# Altium project Internship_IITB.PrjPcb
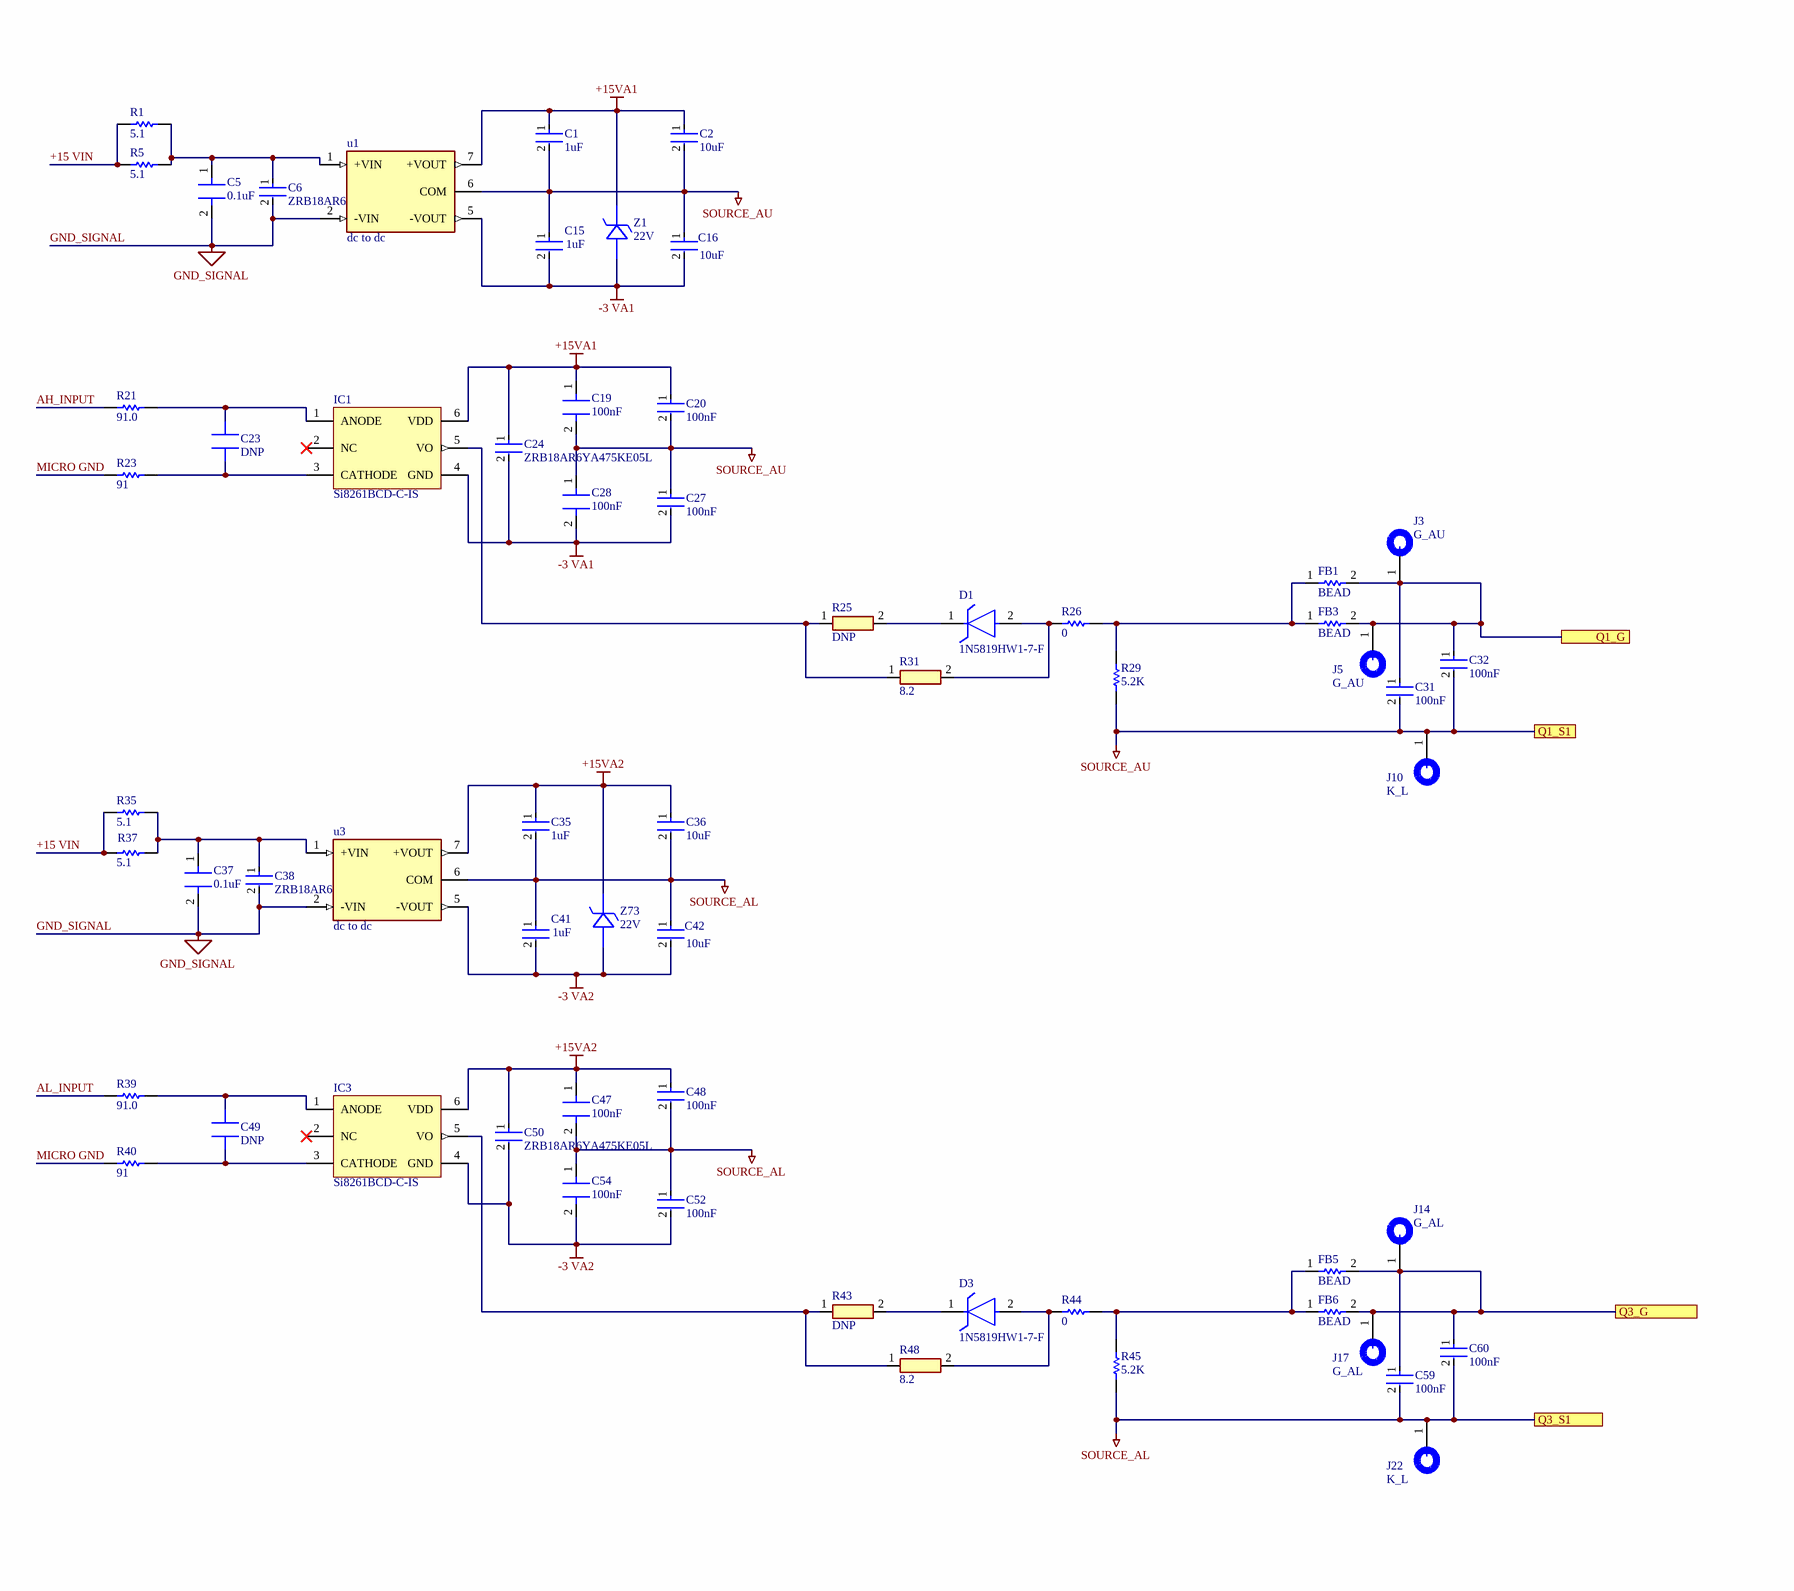
[diagram p0: Schematic_Internship.SchDoc, left]
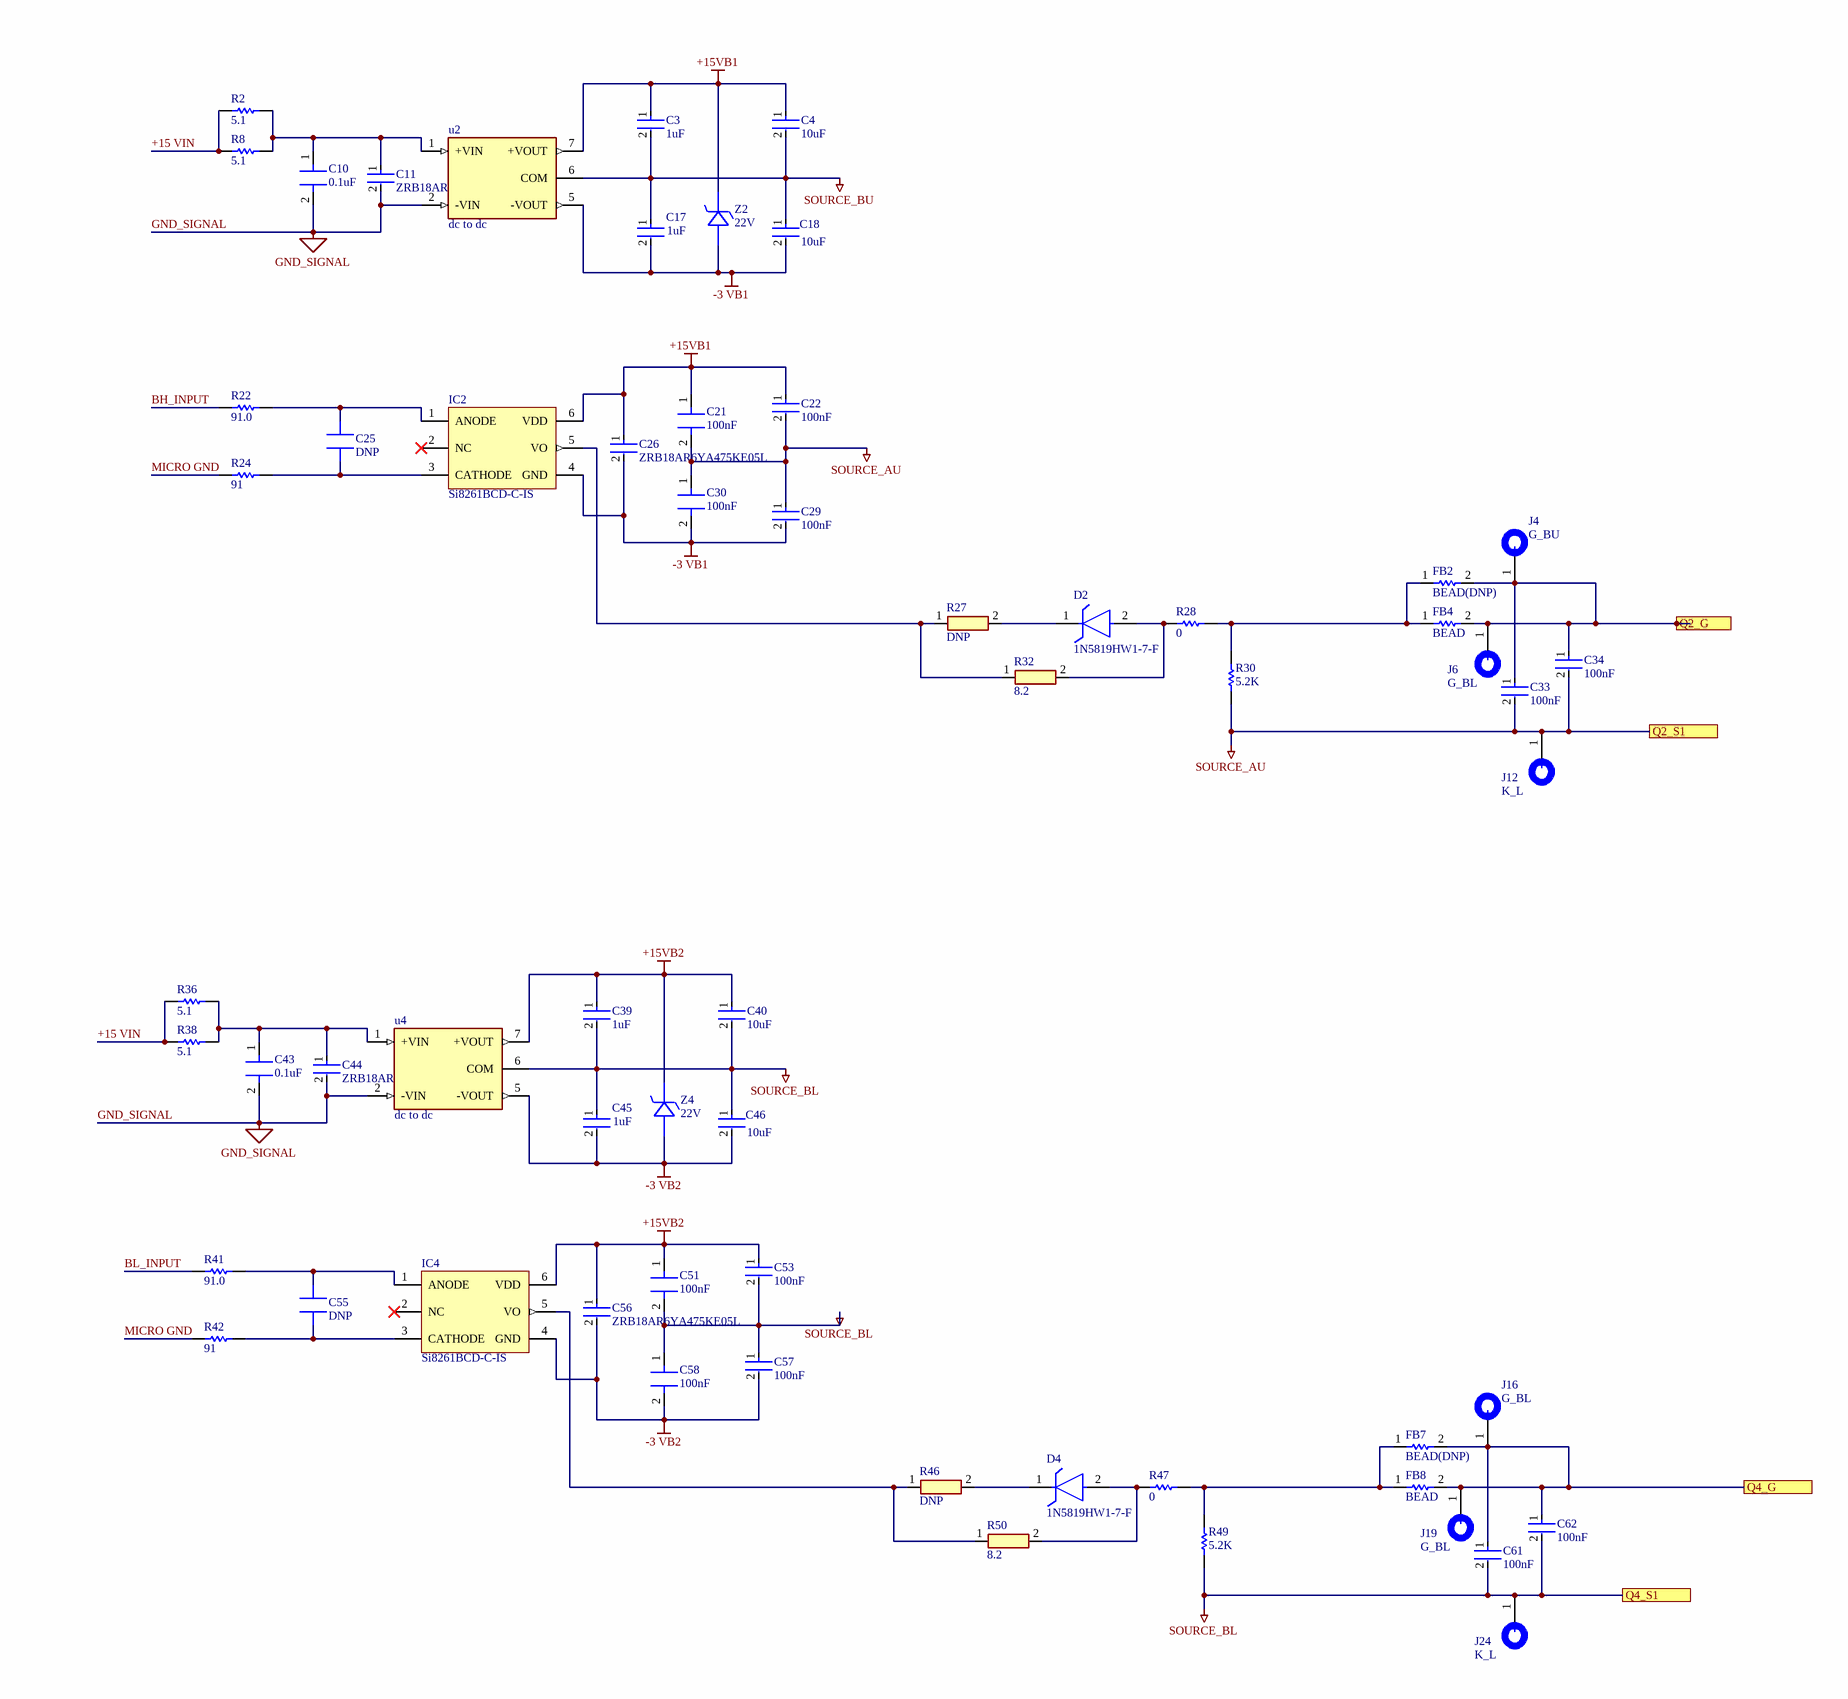
[diagram p1: Schematic_Internship.SchDoc, right]
2 sheets, 156 parts. Net scope: flat (ports and power ports of the same name join across sheets).
Board files: PCB_Internship.PcbDoc, primary_internship.PcbDoc
Sheets:
  Schematic_Internship.SchDoc
  primary_internship.SchDoc

## Sheet Schematic_Internship.SchDoc
size A0; SheetNumber: 1; SheetTotal: 2

### Parts
C1  1uF  [FP-0603-L_1_6_0_15-W_0_8-IPC_A]
C2  10uF  [FP-1206-L_3_2_0_2-W_1_6_0-IPC_A]
C3  1uF  [FP-0603-L_1_6_0_15-W_0_8-IPC_A]
C4  10uF  [FP-1206-L_3_2_0_2-W_1_6_0-IPC_A]
C5  0.1uF  [CAPC1608X90]
C6  ZRB18AR6YA475KE05L  [FP-ZRB18A-0_2-MFG - duplicate]
C10  0.1uF  [CAPC1608X90]
C11  ZRB18AR6YA475KE05L  [FP-ZRB18A-0_2-MFG - duplicate]
C15  1uF  [FP-0603-L_1_6_0_15-W_0_8-IPC_A]
C16  10uF  [FP-1206-L_3_2_0_2-W_1_6_0-IPC_A]
C17  1uF  [FP-0603-L_1_6_0_15-W_0_8-IPC_A]
C18  10uF  [FP-1206-L_3_2_0_2-W_1_6_0-IPC_A]
C19  100nF  [CAPC1608X90]
C20  100nF  [FP-C0603C-CF-IPC_A]
C21  100nF  [CAPC1608X90]
C22  100nF  [FP-C0603C-CF-IPC_A]
C23  DNP  [CAP_CL10_SAM]
C24  ZRB18AR6YA475KE05L  [FP-ZRB18A-0_2-MFG - duplicate]
C25  DNP  [CAP_CL10_SAM]
C26  ZRB18AR6YA475KE05L  [FP-ZRB18A-0_2-MFG - duplicate]
C27  100nF  [FP-C0603C-CF-IPC_A]
C28  100nF  [CAPC1608X90]
C29  100nF  [FP-C0603C-CF-IPC_A]
C30  100nF  [CAPC1608X90]
C31  100nF  [FP-C0603C-CF-IPC_A]
C32  100nF  [FP-C0603C-CF-IPC_A]
C33  100nF  [FP-C0603C-CF-IPC_A]
C34  100nF  [FP-C0603C-CF-IPC_A]
C35  1uF  [FP-0603-L_1_6_0_15-W_0_8-IPC_A]
C36  10uF  [FP-1206-L_3_2_0_2-W_1_6_0-IPC_A]
C37  0.1uF  [CAPC1608X90]
C38  ZRB18AR6YA475KE05L  [FP-ZRB18A-0_2-MFG - duplicate]
C39  1uF  [FP-0603-L_1_6_0_15-W_0_8-IPC_A]
C40  10uF  [FP-1206-L_3_2_0_2-W_1_6_0-IPC_A]
C41  1uF  [FP-0603-L_1_6_0_15-W_0_8-IPC_A]
C42  10uF  [FP-1206-L_3_2_0_2-W_1_6_0-IPC_A]
C43  0.1uF  [CAPC1608X90]
C44  ZRB18AR6YA475KE05L  [FP-ZRB18A-0_2-MFG - duplicate]
C45  1uF  [FP-0603-L_1_6_0_15-W_0_8-IPC_A]
C46  10uF  [FP-1206-L_3_2_0_2-W_1_6_0-IPC_A]
C47  100nF  [CAPC1608X90]
C48  100nF  [FP-C0603C-CF-IPC_A]
C49  DNP  [CAP_CL10_SAM]
C50  ZRB18AR6YA475KE05L  [FP-ZRB18A-0_2-MFG - duplicate]
C51  100nF  [CAPC1608X90]
C52  100nF  [FP-C0603C-CF-IPC_A]
C53  100nF  [FP-C0603C-CF-IPC_A]
C54  100nF  [CAPC1608X90]
C55  DNP  [CAP_CL10_SAM]
C56  ZRB18AR6YA475KE05L  [FP-ZRB18A-0_2-MFG - duplicate]
C57  100nF  [FP-C0603C-CF-IPC_A]
C58  100nF  [CAPC1608X90]
C59  100nF  [FP-C0603C-CF-IPC_A]
C60  100nF  [FP-C0603C-CF-IPC_A]
C61  100nF  [FP-C0603C-CF-IPC_A]
C62  100nF  [FP-C0603C-CF-IPC_A]
D1  1N5819HW1-7-F  [FP-SOD123F_Type_B-MFG]
D2  1N5819HW1-7-F  [FP-SOD123F_Type_B-MFG]
D3  1N5819HW1-7-F  [FP-SOD123F_Type_B-MFG]
D4  1N5819HW1-7-F  [FP-SOD123F_Type_B-MFG]
FB1  BEAD  [RESC1608X55X25LL10T15]
FB2  BEAD(DNP)  [RESC1608X55X25LL10T15]
FB3  BEAD  [RESC1608X55X25LL10T15]
FB4  BEAD  [RESC1608X55X25LL10T15]
FB5  BEAD  [RESC1608X55X25LL10T15]
FB6  BEAD  [RESC1608X55X25LL10T15]
FB7  BEAD(DNP)  [RESC1608X55X25LL10T15]
FB8  BEAD  [RESC1608X55X25LL10T15]
IC1  Si8261BCD-C-IS  [SLAB-SDIP6_L]
IC2  Si8261BCD-C-IS  [SLAB-SDIP6_L]
IC3  Si8261BCD-C-IS  [SLAB-SDIP6_L]
IC4  Si8261BCD-C-IS  [SLAB-SDIP6_L]
J3  G_AU  [FP-S2751-46R-MFG]
J4  G_BU  [FP-S2751-46R-MFG]
J5  G_AU  [FP-S2751-46R-MFG]
J6  G_BL  [FP-S2751-46R-MFG]
J10  K_L  [FP-S2751-46R-MFG]
J12  K_L  [FP-S2751-46R-MFG]
J14  G_AL  [FP-S2751-46R-MFG]
J16  G_BL  [FP-S2751-46R-MFG]
J17  G_AL  [FP-S2751-46R-MFG]
J19  G_BL  [FP-S2751-46R-MFG]
J22  K_L  [FP-S2751-46R-MFG]
J24  K_L  [FP-S2751-46R-MFG]
R1  5.1  [RESC2013X60X35LL10T20]
R2  5.1  [RESC2013X60X35LL10T20]
R5  5.1  [RESC2013X60X35LL10T20]
R8  5.1  [RESC2013X60X35LL10T20]
R21  91.0  [RESC1608X55X25LL10T15]
R22  91.0  [RESC1608X55X25LL10T15]
R23  91  [RESC1608X55X25LL10T15]
R24  91  [RESC1608X55X25LL10T15]
R25  DNP  [RC1206N_YAG]
R26  0  [RESC1608X55X25LL10T15]
R27  DNP  [RC1206N_YAG]
R28  0  [RESC1608X55X25LL10T15]
R29  5.2K  [RESC1608X55X25LL10T15]
R30  5.2K  [RESC1608X55X25LL10T15]
R31  8.2  [RC1206N_YAG]
R32  8.2  [RC1206N_YAG]
R35  5.1  [RESC2013X60X35LL10T20]
R36  5.1  [RESC2013X60X35LL10T20]
R37  5.1  [RESC2013X60X35LL10T20]
R38  5.1  [RESC2013X60X35LL10T20]
R39  91.0  [RESC1608X55X25LL10T15]
R40  91  [RESC1608X55X25LL10T15]
R41  91.0  [RESC1608X55X25LL10T15]
R42  91  [RESC1608X55X25LL10T15]
R43  DNP  [RC1206N_YAG]
R44  0  [RESC1608X55X25LL10T15]
R45  5.2K  [RESC1608X55X25LL10T15]
R46  DNP  [RC1206N_YAG]
R47  0  [RESC1608X55X25LL10T15]
R48  8.2  [RC1206N_YAG]
R49  5.2K  [RESC1608X55X25LL10T15]
R50  8.2  [RC1206N_YAG]
u1  dc to dc  [CONV_R15P21503D]
u2  dc to dc  [CONV_R15P21503D]
u3  dc to dc  [CONV_R15P21503D]
u4  dc to dc  [CONV_R15P21503D]
Z1  22V  [SOD123_DIO]
Z2  22V  [SOD123_DIO]
Z4  22V  [SOD123_DIO]
Z73  22V  [SOD123_DIO]

### Ports
Q1_G, Q1_S1, Q2_G, Q2_S1, Q3_G, Q3_S1, Q4_G, Q4_S1

### Nets
+15VA1: C1.1 C2.1 C19.1 C20.1 C24.1 IC1.6(VDD) u1.7(+VOUT) Z1.1
+15VA2: C35.1 C36.1 C47.1 C48.1 C50.1 IC3.6(VDD) u3.7(+VOUT) Z73.1
+15VB1: C3.1 C4.1 C21.1 C22.1 C26.1 IC2.6(VDD) u2.7(+VOUT) Z2.1
+15VB2: C39.1 C40.1 C51.1 C53.1 C56.1 IC4.6(VDD) u4.7(+VOUT) Z4.1
-3 VA1: C15.2 C16.2 C24.2 C27.2 C28.2 IC1.4(GND) u1.5(-VOUT) Z1.2
-3 VA2: C41.2 C42.2 C50.2 C52.2 C54.2 IC3.4(GND) u3.5(-VOUT) Z73.2
-3 VB1: C17.2 C18.2 C26.2 C29.2 C30.2 IC2.4(GND) u2.5(-VOUT) Z2.2
-3 VB2: C45.2 C46.2 C56.2 C57.2 C58.2 IC4.4(GND) u4.5(-VOUT) Z4.2
GND_SIGNAL: C5.2 C6.2 C10.2 C11.2 C37.2 C38.2 C43.2 C44.2 u1.2(-VIN) u2.2(-VIN) u3.2(-VIN) u4.2(-VIN)
SOURCE_AL: C35.2 C36.2 C41.1 C42.1 C47.2 C48.2 C52.1 C54.1 C59.2 C60.2 J22.1 R45.1 u3.6(COM) ; port Q3_S1
SOURCE_AU: C1.2 C2.2 C15.1 C16.1 C19.2 C20.2 C21.2 C22.2 C27.1 C28.1 C29.1 C30.1 C31.2 C32.2 C33.2 C34.2 J10.1 J12.1 R29.1 R30.1 u1.6(COM) ; port Q1_S1, port Q2_S1
SOURCE_BL: C39.2 C40.2 C45.1 C46.1 C51.2 C53.2 C57.1 C58.1 C61.2 C62.2 J24.1 R49.1 u4.6(COM) ; port Q4_S1
SOURCE_BU: C3.2 C4.2 C17.1 C18.1 u2.6(COM)
+15 VIN: R1.1 R2.1 R5.1 R8.1 R35.1 R36.1 R37.1 R38.1
AH_INPUT: R21.1
AL_INPUT: R39.1
BH_INPUT: R22.1
BL_INPUT: R41.1
MICRO GND: R23.1 R24.1 R40.1 R42.1
NetC5_1: C5.1 C6.1 R1.2 R5.2 u1.1(+VIN)
NetC10_1: C10.1 C11.1 R2.2 R8.2 u2.1(+VIN)
NetC23_1: C23.1 IC1.3(CATHODE) R23.2
NetC23_2: C23.2 IC1.1(ANODE) R21.2
NetC25_1: C25.1 IC2.3(CATHODE) R24.2
NetC25_2: C25.2 IC2.1(ANODE) R22.2
NetC31_1: C31.1 C32.1 FB1.2 FB3.2 J3.1 J5.1 ; port Q1_G
NetC33_1: C33.1 C34.1 FB2.2 FB4.2 J4.1 J6.1 ; port Q2_G
NetC37_1: C37.1 C38.1 R35.2 R37.2 u3.1(+VIN)
NetC43_1: C43.1 C44.1 R36.2 R38.2 u4.1(+VIN)
NetC49_1: C49.1 IC3.3(CATHODE) R40.2
NetC49_2: C49.2 IC3.1(ANODE) R39.2
NetC55_1: C55.1 IC4.3(CATHODE) R42.2
NetC55_2: C55.2 IC4.1(ANODE) R41.2
NetC59_1: C59.1 C60.1 FB5.2 FB6.2 J14.1 J17.1 ; port Q3_G
NetC61_1: C61.1 C62.1 FB7.2 FB8.2 J16.1 J19.1 ; port Q4_G
NetD1_1: D1.1(C) R25.2
NetD1_2: D1.2(A) R26.1 R31.2
NetD2_1: D2.1(C) R27.2
NetD2_2: D2.2(A) R28.1 R32.2
NetD3_1: D3.1(C) R43.2
NetD3_2: D3.2(A) R44.1 R48.2
NetD4_1: D4.1(C) R46.2
NetD4_2: D4.2(A) R47.1 R50.2
NetFB1_1: FB1.1 FB3.1 R26.2 R29.2
NetFB2_1: FB2.1 FB4.1 R28.2 R30.2
NetFB5_1: FB5.1 FB6.1 R44.2 R45.2
NetFB7_1: FB7.1 FB8.1 R47.2 R49.2
NetIC1_5: IC1.5(VO) R25.1 R31.1
NetIC2_5: IC2.5(VO) R27.1 R32.1
NetIC3_5: IC3.5(VO) R43.1 R48.1
NetIC4_5: IC4.5(VO) R46.1 R50.1

Not connected (* = marked no-connect by the designer): IC1 2(NC)*; IC2 2(NC)*; IC3 2(NC)*; IC4 2(NC)*

### Library data of the parts
C1 C3 C15 C17 C35 C39 C41 C45 = CMP-2000-07531-4: Ceramic Capacitor General Use 1uF ±10% 50V X7R 0603; Series: M; Width: 0.031inch; Mount: Surface Mount; Radiation Hardening: No; Voltage Rating (DC): 50V; Packaging: Tape and Reel; Termination: SMD/SMT; Depth: 0.8mm; Case Code (Metric): 1608; Case Code (Imperial): 0603; Height: 0.8mm; Voltage Rating: 50V; Package Quantity: 1; Halogen Free: Halogen Free; Dielectric: X7R; Min Operating Temperature: -55°C; Length: 1.6mm; Construction: Flat; Tolerance: 10%; Thickness: 0.037inch; Max Operating Temperature: 125°C; Case/Package: 0603; Capacitance: 1uF; RoHS Compliant: Yes
C2 C4 C16 C18 C36 C40 C42 C46 = CMP-2000-06324-3: 10 µF ±10% 35V Ceramic Capacitor X7R 1206 (3216 Metric); Thickness: 0.071inch; Mount: Surface Mount; Case Code (Imperial): 1206; Voltage Rating (DC): 35V; RoHS Compliant: Yes; Voltage Rating: 35V; Capacitance: 10uF; Case Code (Metric): 3216; Tolerance: 10%; Height: 1.6mm; Packaging: Tape and Reel; Resistor Type: Ceramic; REACH SVHC: No SVHC; Max Operating Temperature: 125°C; Termination: SMD/SMT; Package Quantity: 2000; Width: 1.6mm; Case/Package: 1206; Length: 0.126inch; Series: M; Dielectric: X7R; Min Operating Temperature: -55°C
C5 C10 C19 C21 C28 C30 C37 C43 C47 C51 C54 C58 = MM035C104KCZ2A_1: 0.1 µF ±10% 50V Ceramic Capacitor X7R 0603 (1608 Metric)
C6 C11 C24 C26 C38 C44 C50 C56 = CMP-06035-062684-1: CAP CER 4.7UF 35V X5R 0603; Tolerance: 10%; Voltage Rating: 35V; Voltage Rating (DC): 35V; Mount: Surface Mount; Case Code (Metric): 1608; RoHS Compliant: Yes; Packaging: Cut Tape; Width: 0.031inch; Thickness: 0.047inch; Dielectric: X5R; Case/Package: 0603; Length: 0.063inch; REACH SVHC: No SVHC; Capacitance: 4.7uF; Min Operating Temperature: -55°C; Max Operating Temperature: 85°C; Case Code (Imperial): 0603
C20 C22 C27 C29 C31-C34 C48 C52 C53 C57 C59-C62 = CMP-2006-03046-3: CAP CER 10000PF 50V X7R 0603; Manufacturer: KEMET; Manufacturer Part Number: C0603C103K5RACTU; Temperature Coefficient: 30ppm/°C; Capacitance: 10,000 pF; Automotive Grade: Grade 1; Material: Ceramic; Value: 10,000 pF; Tolerance: 0.1; Voltage Rating: 50 V; Digikey Description: CAP CER 10000PF 50V X7R 0603; ComponentLink2Description: Datasheet; Mouser Description: Ceramic Capacitor 0.01Uf, 50V, X7R, 10%, 0603, Full Reel; ComponentLink2URL: https://api.kemet.com/component-edge/download/datasheet/C0603C100J5GACAUTO.pdf; Package: C0603C-CF; RoHS: TRUE; Octopart: https://octopart.com/c0603c103k5ractu-kemet-133094; Device Class L1: Passive Components; Temperature Range Low: -55°C; Automotive: Yes; Category: Cap; Lead Free: Yes; Temperature: -55°C to +125°C; Temperature Range High: +125°C; Temperature Characteristic: X7R; Height: 0.87mm; Device Class L3: Ceramic Capacitors; Device Class L2: Capacitors
C23 C25 C49 C55 = CL10B104KB8NNWC: 0.1 µF ±10% 50V Ceramic Capacitor X7R 0603 (1608 Metric); Mfr_Name: Samsung; Digi-Key_Part_Number_3: 1276-1935-6-ND; Digi-Key_Part_Number_2: 1276-1935-1-ND; Digi-Key_Part_Number_1: 1276-1935-2-ND
D1-D4 = CMP-12791-000028-1: DIODE SBR 40V 1A SOD123F; Manufacturer: Diodes Inc.; Max Junction Temp: +125°C; Capacitance: 30pF; Value: 30pF; Peak Reverse Current: 0.5mA; Max Surge Forward Current: 30A; ComponentLink2Description: Datasheet; Temperature: -55°C to +125°C; Lead Free: Yes; Package: SOD123F (Type B); Reverse Voltage: 40V; Device Class L2: Diodes; Manufacturer Part Number: 1N5819HW1-7-F; ComponentLink2URL: https://www.diodes.com/assets/Datasheets/1N5819HW1.pdf; Automotive: No; RoHS: TRUE; Height: 1.15mm; Digikey Description: DIODE SBR 40V 1A SOD123F; Max Repetitive Reverse Voltage: 40V; Forward Current: 1A; Footprint Url: https://www.diodes.com/assets/Package-Files/SOD123F%20(Type%20B).pdf; Temperature Range High: +125°C; Octopart: https://octopart.com/1n5819hw1-7-f-diodes+inc.-67250096; Mouser Description: Schottky Diodes & Rectifiers 1A SBR 40Vrrm 0.51Vf 0.5mA 28Vrms; Device Class L3: Rectifier Diodes; Ipc Land Pattern Name: SOD350180X98-2; Device Class L1: Discrete Semiconductors; Category: Diode; Temperature Range Low: -55°C
FB1-FB8 = CMP-2100-03667-1_1: Chip Resistor, 0 Ohm, +/- 5%, 0.1 W, -55 to 155 degC, 0603 (1608 Metric), RoHS, Tape and Reel; Manufacturer: Yageo; Temperature Coefficient: 200ppm/degreesC; Voltage Rating: 50V; Power Rating: 100mW; Resistance: 0mOhm; Width: 0.8mm; Max Operating Temperature: 155degC; Tolerance: 5%; Package Reference: 0603; Height: 0.45mm; Depth: 0.8mm; Package Description: 2-Pin Surface Mount Device, Body 1.6 x 0.8 mm; Termination: SMD/SMT; Package Quantity: 5000; Case/Package: 0603; Case Code (Imperial): 0603; Radiation Hardening: No; Number of Pins: 2; Length: 1.6mm; Lead Free: LeadFree; Voltage Rating (DC): 50V; Military Standard: Not; Datasheet URL: http://www.yageo.com/NewPortal/yageodocoutput?fileName=/pdf/R-Chip/PYu-RC_Group_51_RoHS_L_5.pdf; Manufacturer URL: http://www.yageo.com/; Packaging: TapeandReel; Case Code (Metric): 1608; Min Operating Temperature: -55degC; Composition: ThickFilm; RoHSCompliant: true; Contact Plating: Tin; Datasheet Version: Rev. 5, 10/2016; REACH SVHC: NoSVHC
IC1-IC4 = CMP-0512-00085-1: Led Emulator Input, 4.0 A Isolated Gate Drivers, 5 to 30 V Driver Supply, 5 kVRMS Isolation Rating, -40 to 125 degC, 6-pin SOP; Manufacturer: Silicon Labs; 10kV surge: TRUE; UVLO Voltage: 12 V; Overlap Protection & Dead Time Control: FALSE; Driver Supply: 5 to 30 V; Max. Prop. Delay (ns): 60; Isolation Rating (Input-Output, kVrms): 5; Sub-Family: ISOdrivers; ComponentLink1Description: Manufacturer URL; ComponentLink3URL: http://www.silabs.com/Support%20Documents/TechnicalDocs/Si826x.pdf; ComponentLink2URL: http://www.silabs.com/Support%20Documents/TechnicalDocs/Si826x.pdf; ComponentLink2Description: Datasheet; ComponentLink3Description: Package Specification; PartNumber: Si8261BCD-C-IS; ComponentLink1URL: http://www.silabs.com/; PackageDescription: 6-Pin SDIP, Body 4.58 x 7.5 mm, Pitch 1.27 mm; Mounting Technology: Surface Mount; DatasheetVersion: Rev. 0.9; PackageReference: SDIP6
J3-J6 J10 J12 J14 J16 J17 J19 J22 J24 = CMP-15817-000010-1: PC TEST POINT NATURAL; Plating: Tin; Body Material: Brass; Color: Natural; Material: Copper Alloy; Mount: Surface Mount; Packaging: Cut Tape
R1 R2 R5 R8 R35-R38 = RC0805JR-075R1L: Thick Film Resistors - SMD 5.1 Ohms 125 mW 0805 5%; Manufacturer: Yageo; Part Number: RC0805JR-075R1L
R21-R24 R39-R42 = CMP-2000-04159-1: 91 Ohms ±1% 0.1W, 1/10W Chip Resistor 0603 (1608 Metric) Moisture Resistant Thick Film; Manufacturer: Yageo; Part Number: RC0603FR-0791RL
R25 R27 R31 R32 R43 R46 R48 R50 = RC1206FR-078R2L: 8.2 Ohms ±1% 0.25W, 1/4W Chip Resistor 1206 (3216 Metric) Moisture Resistant Thick Film; Mfr_Name: Yageo; Digi-Key_Part_Number_3: 311-8.20FRTR-ND; Digi-Key_Part_Number_2: 311-8.20FRDKR-ND; Digi-Key_Part_Number_1: 311-8.20FRCT-ND
R26 R28 R44 R47 = CMP-2100-03667-1: Chip Resistor, 0 Ohm, +/- 5%, 0.1 W, -55 to 155 degC, 0603 (1608 Metric), RoHS, Tape and Reel; Manufacturer: Yageo; Temperature Coefficient: 200ppm/degreesC; Voltage Rating: 50V; Power Rating: 100mW; Resistance: 0mOhm; Width: 0.8mm; Max Operating Temperature: 155degC; Tolerance: 5%; Package Reference: 0603; Height: 0.45mm; Depth: 0.8mm; Package Description: 2-Pin Surface Mount Device, Body 1.6 x 0.8 mm; Termination: SMD/SMT; Package Quantity: 5000; Case/Package: 0603; Case Code (Imperial): 0603; Radiation Hardening: No; Number of Pins: 2; Length: 1.6mm; Lead Free: LeadFree; Voltage Rating (DC): 50V; Military Standard: Not; Datasheet URL: http://www.yageo.com/NewPortal/yageodocoutput?fileName=/pdf/R-Chip/PYu-RC_Group_51_RoHS_L_5.pdf; Manufacturer URL: http://www.yageo.com/; Packaging: TapeandReel; Case Code (Metric): 1608; Min Operating Temperature: -55degC; Composition: ThickFilm; RoHSCompliant: true; Contact Plating: Tin; Datasheet Version: Rev. 5, 10/2016; REACH SVHC: NoSVHC
R29 R30 R45 R49 = CMP-1012-00091-2: Chip Resistor, 5.1 KOhm, +/- 5%, 0.1 W, -55 to 155 degC, 0603 (1608 Metric), RoHS, Tape and Reel; Manufacturer: Yageo; Resistance: 5.1kOhms; Voltage Rating: 50V; Temperature Coefficient: 100PPM/C; Power Rating: 100mW; Mounting Technology: SurfaceMount; Case Code - in: 0603; Product: ThickFilmResistorsGeneralPurpose; Series: RC; Packaging: Reel; Tolerance: 5%; Operating Temperature Range: -55Cto+155C; Package Description: 2-Pin Surface Mount Device, Body 1.6 x 0.8 mm; Manufacturer URL: http://www.yageo.com/; Datasheet Version: Rev. 7, 05/2017; Termination Style: SMD/SMT; Package Reference: 0603; Datasheet URL: http://www.yageo.com/documents/recent/PYu-RC_Group_51_RoHS_L_7.pdf; Case Code - mm: 1608
u1-u4 = R15P21503D: 2W DC/DC-Converter 'ECONOLINE' SIP7 6.4kV unreg; MF: Recom Power; MP: R15P21503D; Package: SIP-7 Recom Power; Value: *; Digi-Key_Part_Number: 945-3070-5-ND; SnapEDA_Link: https://www.snapeda.com/parts/R15P21503D/Recom%20Power/view-part/3601956/?ref=snap; Check_prices: https://www.snapeda.com/parts/R15P21503D/Recom%20Power/view-part/3601956/?ref=eda
Z1 Z2 Z4 Z73 = MMSZ5251B-7-F: Zener Diode 22 V 500 mW ±5% Surface Mount SOD-123; Mfr_Name: Diodes Inc; Digi-Key_Part_Number_3: MMSZ5251B-FDITR-ND; Digi-Key_Part_Number_2: MMSZ5251B-FDIDKR-ND; Digi-Key_Part_Number_1: MMSZ5251B-FDICT-ND

## Sheet primary_internship.SchDoc
size A0; SheetNumber: 2; SheetTotal: 2
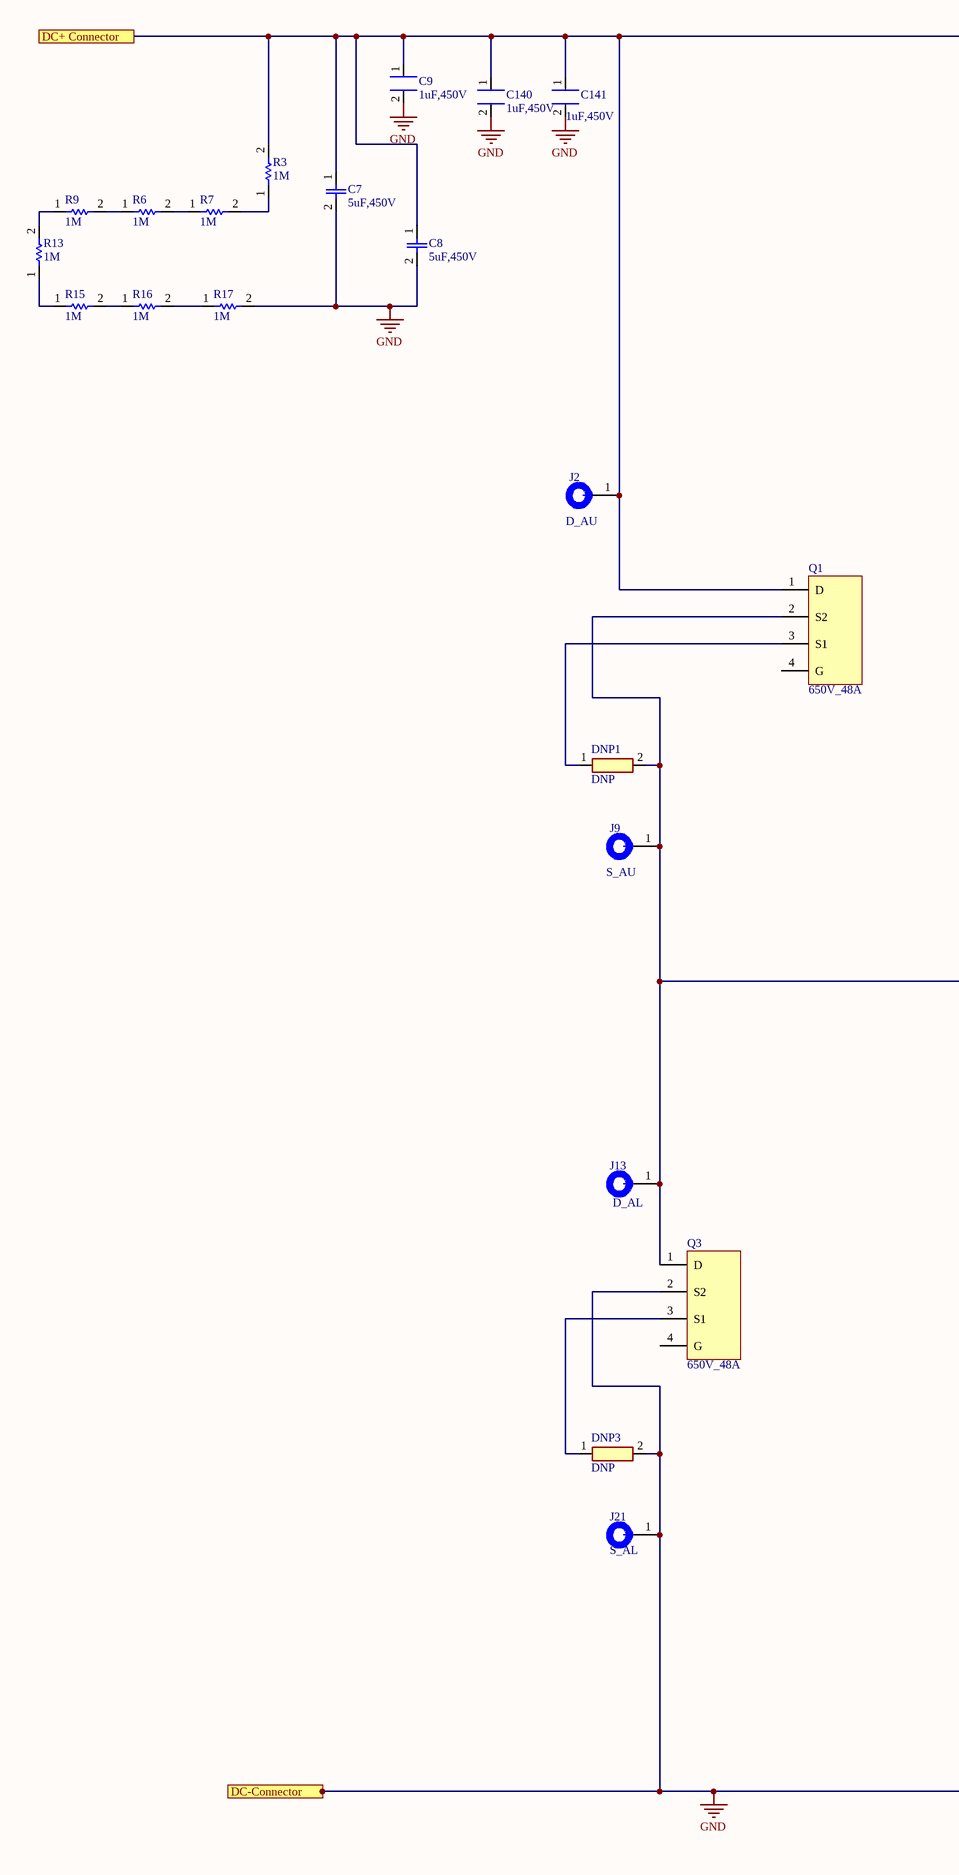
[diagram p2: primary_internship.SchDoc, left]
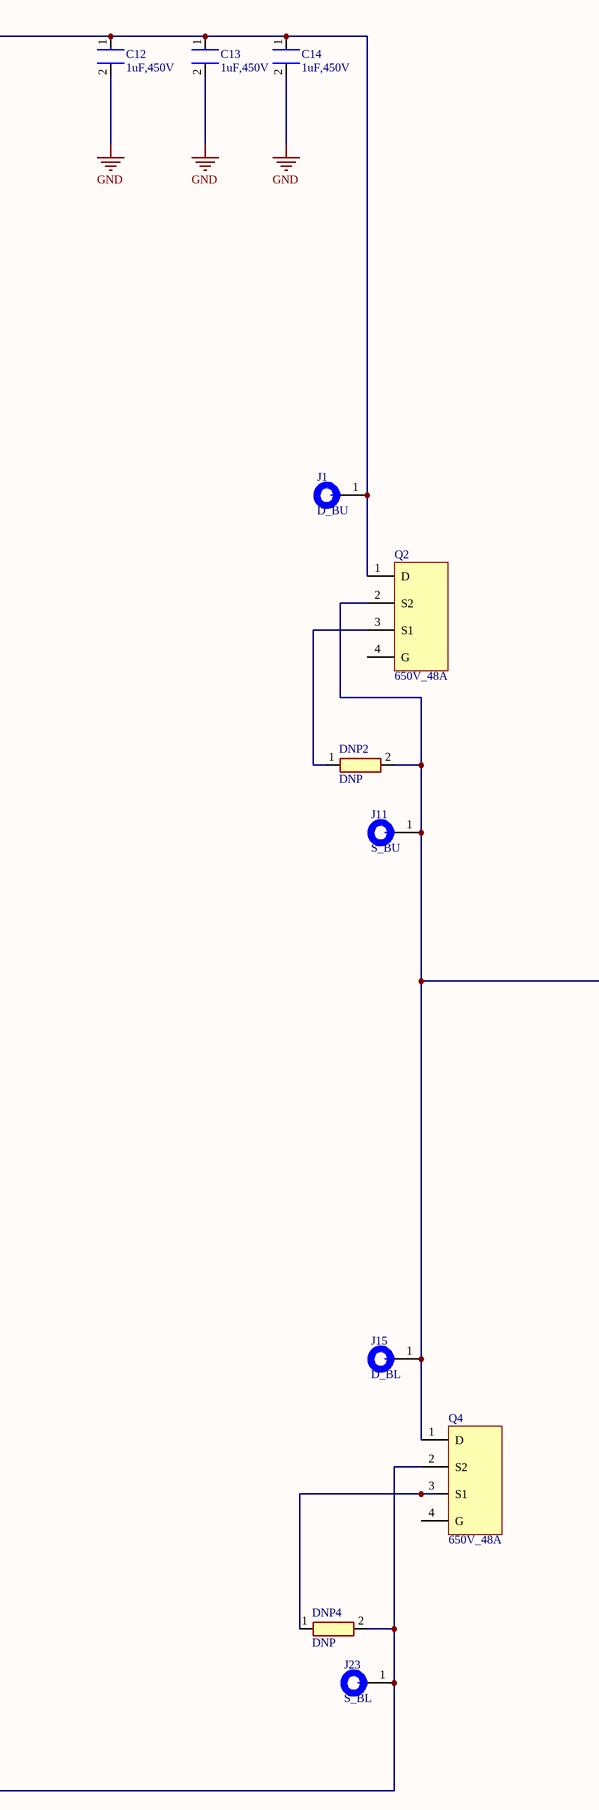
[diagram p3: primary_internship.SchDoc, right]

### Parts
C7  5uF,450V  [CAP_B32774D4505K000_TDK]
C8  5uF,450V  [CAP_B32774D4505K000_TDK]
C9  1uF,450V  [CAP_5035_TDK]
C12  1uF,450V  [CAP_5035_TDK]
C13  1uF,450V  [CAP_5035_TDK]
C14  1uF,450V  [CAP_5035_TDK]
C140  1uF,450V  [CAP_5035_TDK]
C141  1uF,450V  [CAP_5035_TDK]
DNP1  DNP  [RC1206N_YAG]
DNP2  DNP  [RC1206N_YAG]
DNP3  DNP  [RC1206N_YAG]
DNP4  DNP  [RC1206N_YAG]
J1  D_BU  [FP-S2751-46R-MFG]
J2  D_AU  [FP-S2751-46R-MFG]
J9  S_AU  [FP-S2751-46R-MFG]
J11  S_BU  [FP-S2751-46R-MFG]
J13  D_AL  [FP-S2751-46R-MFG]
J15  D_BL  [FP-S2751-46R-MFG]
J21  S_AL  [FP-S2751-46R-MFG]
J23  S_BL  [FP-S2751-46R-MFG]
Q1  650V_48A
Q2  650V_48A
Q3  650V_48A
Q4  650V_48A
R3  1M  [RESC3216X70X50LL05T20]
R6  1M  [RESC3216X70X50LL05T20]
R7  1M  [RESC3216X70X50LL05T20]
R9  1M  [RESC3216X70X50LL05T20]
R13  1M  [RESC3216X70X50LL05T20]
R15  1M  [RESC3216X70X50LL05T20]
R16  1M  [RESC3216X70X50LL05T20]
R17  1M  [RESC3216X70X50LL05T20]

### Ports
DC+ Connector, DC-Connector

### Nets
GND: C7.2 C8.2 C9.2 C12.2 C13.2 C14.2 C140.2 C141.2 DNP3.2 DNP4.2 J21.1 J23.1 Q3.2(S2) Q4.2(S2) R17.2 ; port DC-Connector
NetC7_1: C7.1 C8.1 C9.1 C12.1 C13.1 C14.1 C140.1 C141.1 J1.1 J2.1 Q1.1(D) Q2.1(D) R3.2 ; port DC+ Connector
NetDNP1_1: DNP1.1 Q1.3(S1)
NetDNP1_2: DNP1.2 J9.1 J13.1 Q1.2(S2) Q3.1(D)
NetDNP2_1: DNP2.1 Q2.3(S1)
NetDNP2_2: DNP2.2 J11.1 J15.1 Q2.2(S2) Q4.1(D)
NetDNP3_1: DNP3.1 Q3.3(S1)
NetDNP4_1: DNP4.1 Q4.3(S1)
NetR3_1: R3.1 R7.2
NetR6_1: R6.1 R9.2
NetR6_2: R6.2 R7.1
NetR9_1: R9.1 R13.2
NetR13_1: R13.1 R15.1
NetR15_2: R15.2 R16.1
NetR16_2: R16.2 R17.1

Not connected (* = marked no-connect by the designer): Q1 4(G); Q2 4(G); Q3 4(G); Q4 4(G)

### Library data of the parts
C7 C8 = B32774D4505K000: 5 µF Film Capacitor 450V Polypropylene (PP), Metallized Radial; Mfr_Name: TDK; Digi-Key_Part_Number_1: 495-4828-ND
C9 C12-C14 C140 C141 = CKG45NX7T2W105M500JH: 1 µF ±20% 450V Ceramic Capacitor X7T Stacked SMD, 2 J-Lead; Mfr_Name: TDK; Digi-Key_Part_Number_3: 445-7100-6-ND; Digi-Key_Part_Number_2: 445-7100-2-ND; Digi-Key_Part_Number_1: 445-7100-1-ND
DNP1-DNP4 = RC1206FR-078R2L: as R25 on sheet Schematic_Internship; Digi-Key_Part_Number_3: 311-8.20FRTR-ND; Digi-Key_Part_Number_2: 311-8.20FRDKR-ND; Digi-Key_Part_Number_1: 311-8.20FRCT-ND
J1 J2 J9 J11 J13 J15 J21 J23 = CMP-15817-000010-1: as J3 on sheet Schematic_Internship; Color: Natural; Material: Copper Alloy; Mount: Surface Mount; Packaging: Cut Tape
Q1-Q4 = SIC MOS TO247-4L 650V: N-Channel 650 V 47A (Tc) 176W (Tc) Through Hole TO-247-4L
R3 R6 R7 R9 R13 R15-R17 = CMP-2003-00309-1: Thick Film Resistors - SMD 1206 1Mohms 1% Tol AEC-Q200; Manufacturer: Panasonic; Part Number: ERJ-8ENF3321V